# Altium schematic sheet A1.0-电源-1.1-DC-DC12V输入转5V和3.3V-24.10.16.SchDoc
size A4
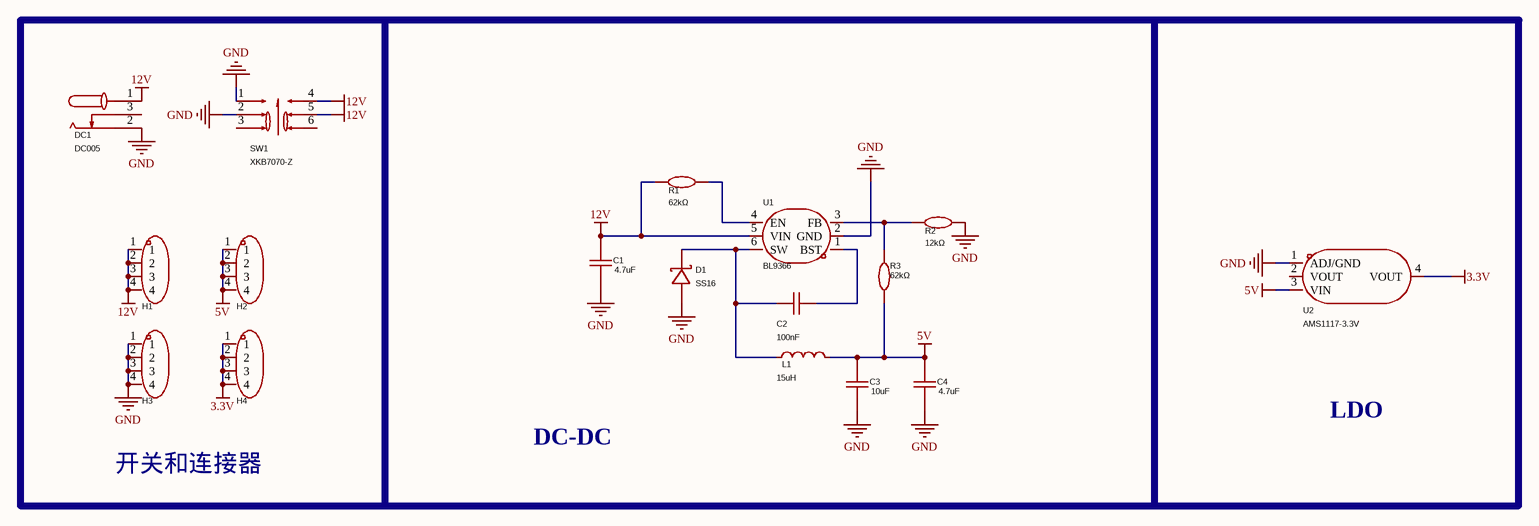
[diagram p0: A1.0-电源-1.1-DC-DC12V输入转5V和3.3V-24.10.16.SchDoc]

## Parts
C1  4.7uF  [C0603]
C2  100nF  [C0603]
C3  10uF  [C0603]
C4  4.7uF  [C0603]
D1  SS16  [SMA_L4.3-W2.6-LS5.2-RD]
DC1  DC005  [DC-IN-TH_DC005]
H1  PZ254V-11-04P  [HDR-TH_4P-P2.54-V-M]  (value not drawn)
H2  PZ254V-11-04P  [HDR-TH_4P-P2.54-V-M]  (value not drawn)
H3  PZ254V-11-04P  [HDR-TH_4P-P2.54-V-M]  (value not drawn)
H4  PZ254V-11-04P  [HDR-TH_4P-P2.54-V-M]  (value not drawn)
L1  15uH  [IND-SMD_L11.5-W10.0_FXL1040]
R1  62kΩ  [R0603]
R2  12kΩ  [R0603]
R3  62kΩ  [R0603]
SW1  XKB7070-Z  [SW-TH_6P-L7.0-W7.0-P2.00]
U1  BL9366  [SOT-23-6_L2.9-W1.6-P0.95-LS2.8-BR]
U2  AMS1117-3.3V  [SOT-223-4_L6.5-W3.5-P2.30-LS7.0-TR]

## Nets
3.3V: H4.1 H4.2 H4.3 H4.4 U2.4(VOUT)
5V: C3.2 C4.2 H2.1 H2.2 H2.3 H2.4 L1.2 R3.1 U2.3(VIN)
12V: C1.2 DC1.1 H1.1 H1.2 H1.3 H1.4 R1.1 SW1.4 SW1.5 U1.5(VIN)
GND: C1.1 C3.1 C4.1 D1.2(A) DC1.2 H3.1 H3.2 H3.3 H3.4 R2.2 SW1.1 SW1.2 U1.2(GND) U2.1(ADJ/GND)
NetC2_1: C2.1 D1.1(K) L1.1 U1.6(SW)
NetC2_2: C2.2 U1.1(BST)
NetR1_2: R1.2 U1.4(EN)
NetR2_1: R2.1 R3.2 U1.3(FB)

Not connected (* = marked no-connect by the designer): DC1 3; SW1 3 6; U2 2(VOUT)

## Notes on the sheet
- LDO
- 开关和连接器
- DC-DC

## Library data of the parts
C1 C4 = 0603X475K250NT: Manufacturer: FH(风华); Add into BOM: yes; Tolerance: ±10%; Voltage Rated: 25V; Temperature Coefficient: X5R; Symbol: 0603X475K250NT; Device: 0603X475K250NT; LCSC Part Name: 4.7uF ±10% 25V; Supplier Part: C2936640; Manufacturer Part: 0603X475K250NT; Supplier Footprint: 0603; JLCPCB Part Class: Extended Part; Datasheet: https://atta.szlcsc.com/upload/public/pdf/source/20211229/CBCEA01A18300571AA3BD7304DEDFA2D.pdf; Supplier: LCSC; Convert to PCB: yes; Value: 4.7uF; Comment_1: 4.7uF
C2 = 0603B104K500NT: Manufacturer: FH(风华); Add into BOM: yes; Tolerance: ±10%; Voltage Rated: 50V; Temperature Coefficient: X7R; Symbol: 0603B104K500NT; Device: 0603B104K500NT; LCSC Part Name: 100nF ±10% 50V; Supplier Part: C30926; Manufacturer Part: 0603B104K500NT; Supplier Footprint: 0603; JLCPCB Part Class: Extended Part; Datasheet: https://atta.szlcsc.com/upload/public/pdf/source/20200305/C486355_26A10D38EF8C2A5C37091D0039909270.pdf; Supplier: LCSC; Convert to PCB: yes; Value: 100nF; Comment_1: 100nF
C3 = 0603X106M250NT: Manufacturer: FH(风华); Add into BOM: yes; Tolerance: ±20%; Voltage Rated: 25V; Temperature Coefficient: X5R; Symbol: 0603X106M250NT; Device: 0603X106M250NT; LCSC Part Name: 10uF ±20% 25V; Supplier Part: C479655; Manufacturer Part: 0603X106M250NT; Supplier Footprint: 0603; JLCPCB Part Class: Extended Part; Datasheet: https://atta.szlcsc.com/upload/public/pdf/source/20200305/C486355_26A10D38EF8C2A5C37091D0039909270.pdf; Supplier: LCSC; Convert to PCB: yes; Value: 10uF; Comment_1: 10uF
D1 = SS16_C2481: Manufacturer: MDD(辰达半导体); Add into BOM: yes; Diode Configuration: 独立式; Forward Voltage (Vf@If): 700mV@1A; Reverse Voltage (Vr): 60V; Rectified Current: 1A; Reverse Leakage Current (Ir): 300uA@60V; Symbol: SS16; Device: SS16_C2481; LCSC Part Name: 电压:60V 电流:1A; Supplier Part: C2481; Manufacturer Part: SS16; Supplier Footprint: SMA(DO-214AC); JLCPCB Part Class: Extended Part; Datasheet: https://atta.szlcsc.com/upload/public/pdf/source/20230712/2DB6064CFBB99DE6DB116BEE8208BE66.pdf; Supplier: LCSC; Convert to PCB: yes; Comment_1: SS16
DC1 = DC005: Manufacturer: SHOU HAN(首韩); Symbol: DC005_C431533; Add into BOM: yes; Connector Type: DC电源插座; Inside Contact Diameter: 2mm; Outside Contact Diameter: 6.3mm; Current Rating (Max): 500mA; Voltage Rating (Max): 30V; Device: DC005; LCSC Part Name: DC电源插座 内径:2mm 外径:6.3mm; Supplier Part: C431533; Manufacturer Part: DC005; Supplier Footprint: 插件; JLCPCB Part Class: Extended Part; Datasheet: https://atta.szlcsc.com/upload/public/pdf/source/20190925/C431533_4751811035784AC1D38EBC85F7905E99.pdf; Supplier: LCSC; Convert to PCB: yes; Mounting Style: 弯插; Operating Temperature Range: -40℃~+55℃; Comment_1: DC005
H1-H4 = PZ254V-11-04P: Manufacturer: XFCN(兴飞); Symbol: PZ254V-11-04P_C2691448; Add into BOM: yes; Pin Structure: 1x4P; Pitch: 2.54mm; Circluar Pins/Square Pins: 方针; Current Rating (Max): 3A; Voltage Rating (Max): 250V; Device: PZ254V-11-04P; LCSC Part Name: 间距:2.54mm 1x4P 直插 方针; Supplier Part: C2691448; Manufacturer Part: PZ254V-11-04P; Supplier Footprint: 插件,P=2.54mm; JLCPCB Part Class: Extended Part; Datasheet: https://atta.szlcsc.com/upload/public/pdf/source/20200309/C492403_F9F19131791D08044AD4F84F8E751A34.pdf; Supplier: LCSC; Convert to PCB: yes; Row Spacing: -; Mounting Type: 直插; Number of Rows: 单排; Number of Pins: 4P; Length of Mating Pin: 6mm; Insulation Height: 2.5mm; Length of End Connection Pin: 3mm; Contact Material: -; Operating Temperature Range: -40℃~+105℃; Color: 黑色; Comment_1: PZ254V-11-04P
L1 = FXL1040-150-M: Manufacturer: cjiang(长江微电); Add into BOM: yes; Tolerance: ±20%; Rated Current: 6.5A; Saturation Current (Isat): 7A; DC Resistance (DCR): 45mΩ; Type: 一体成型电感; Symbol: FXL1040-150-M; Device: FXL1040-150-M; LCSC Part Name: 15uH ±20% 7A; Supplier Part: C475916; Manufacturer Part: FXL1040-150-M; Supplier Footprint: SMD,11.5x10mm; JLCPCB Part Class: Extended Part; Datasheet: https://atta.szlcsc.com/upload/public/pdf/source/20240426/3189EA8206330E2108542F9E34E540E7.pdf; Supplier: LCSC; Convert to PCB: yes; Value: 15uH; Comment_1: 15uH
R1 R3 = 0603WAF6202T5E: Manufacturer: UNI-ROYAL(厚声); Add into BOM: yes; Tolerance: ±1%; Power(Watts): 100mW; Overload Voltage (Max): 75V; Temperature Coefficient: ±100ppm/℃; Symbol: 0603WAF6202T5E; Device: 0603WAF6202T5E; LCSC Part Name: 62kΩ ±1% 100mW 厚膜电阻; Supplier Part: C23221; Manufacturer Part: 0603WAF6202T5E; Supplier Footprint: 0603; JLCPCB Part Class: Extended Part; Datasheet: https://atta.szlcsc.com/upload/public/pdf/source/20200306/C422600_1E6D84923E4A46A82E41ADD87F860B5C.pdf; Supplier: LCSC; Convert to PCB: yes; Type: 厚膜电阻; Value: 62kΩ; Operating Temperature Range: -55℃~+155℃; Comment_1: 62kΩ
R2 = 0603WAF1202T5E: Manufacturer: UNI-ROYAL(厚声); Add into BOM: yes; Tolerance: ±1%; Power(Watts): 100mW; Overload Voltage (Max): 75V; Temperature Coefficient: ±100ppm/℃; Symbol: 0603WAF1202T5E; Device: 0603WAF1202T5E; LCSC Part Name: 12kΩ ±1% 100mW 厚膜电阻; Supplier Part: C22790; Manufacturer Part: 0603WAF1202T5E; Supplier Footprint: 0603; JLCPCB Part Class: Basic Part; Datasheet: https://atta.szlcsc.com/upload/public/pdf/source/20200306/C422600_1E6D84923E4A46A82E41ADD87F860B5C.pdf; Supplier: LCSC; Convert to PCB: yes; Type: 厚膜电阻; Value: 12kΩ; Operating Temperature Range: -55℃~+155℃; Comment_1: 12kΩ
SW1 = XKB7070-Z: Manufacturer: XKB Connectivity(中国星坤); Add into BOM: yes; Self Lock / No Lock: 自锁; Actuator Style: 矩形按钮; Contact Current: 100mA; Voltage Rating (AC): 250V; Voltage Rating (DC): 30V; Insulation Resistance: 100MΩ; Actuator/Cap Color: 蓝色; With Lamp: 不带; Pin Style: PC引脚; Operating Force: 160gf; Mechanical Life: 10万次; Symbol: XKB7070-Z; Device: XKB7070-Z; LCSC Part Name: 按键开关   7*7插件自锁 蓝白黑; Supplier Part: C318863; Manufacturer Part: XKB7070-Z; Supplier Footprint: 插件; JLCPCB Part Class: Extended Part; Datasheet: https://atta.szlcsc.com/upload/public/pdf/source/20211015/75A682A27A424BDE8D93C2CFA14C38FE.pdf; Supplier: LCSC; Convert to PCB: yes; IP Rating: -; Mounting Style: 直插; Operating Temperature: -15℃~+55℃; Comment_1: XKB7070-Z
U1 = BL9366: Manufacturer: BL(上海贝岭); Add into BOM: yes; Symbol: BL9366; Device: BL9366; LCSC Part Name: BL9366; Supplier Part: C3032924; Manufacturer Part: BL9366; Supplier Footprint: SOT-23-6; JLCPCB Part Class: Extended Part; Datasheet: https://atta.szlcsc.com/upload/public/pdf/source/20220610/53ABC6B13C638F995BB3224F50255EDB.pdf; Supplier: LCSC; Convert to PCB: yes; Comment_1: BL9366
U2 = AMS1117-3.3V_C5120765: Manufacturer: MSKSEMI(美森科); Add into BOM: yes; Output Type: 固定; Maximum Input Voltage: 18V; Output Voltage: 3.3V; MAX Output Current: 1A; Dropout Voltage: 1.4V@(1A); standby current: 12mA; Output Polarity: 正极; Number of Outputs: 1; Symbol: ams1117-3.3v_c5120765; Device: AMS1117-3.3V_C5120765; LCSC Part Name: 输入18V 输出3.3V 1A; Supplier Part: C5120765; Manufacturer Part: AMS1117-3.3V; Supplier Footprint: SOT-223; JLCPCB Part Class: Extended Part; Datasheet: https://atta.szlcsc.com/upload/public/pdf/source/20230802/7000FCAFF33971783A269E7BD69EFE08.pdf; Supplier: LCSC; Convert to PCB: yes; Operating Temperature: 0℃~+125℃; Comment_1: AMS1117-3.3V